# Altium schematic sheet CPU.SchDoc
size 297 x 209 mm; SheetNumber: 2; SheetTotal: 4
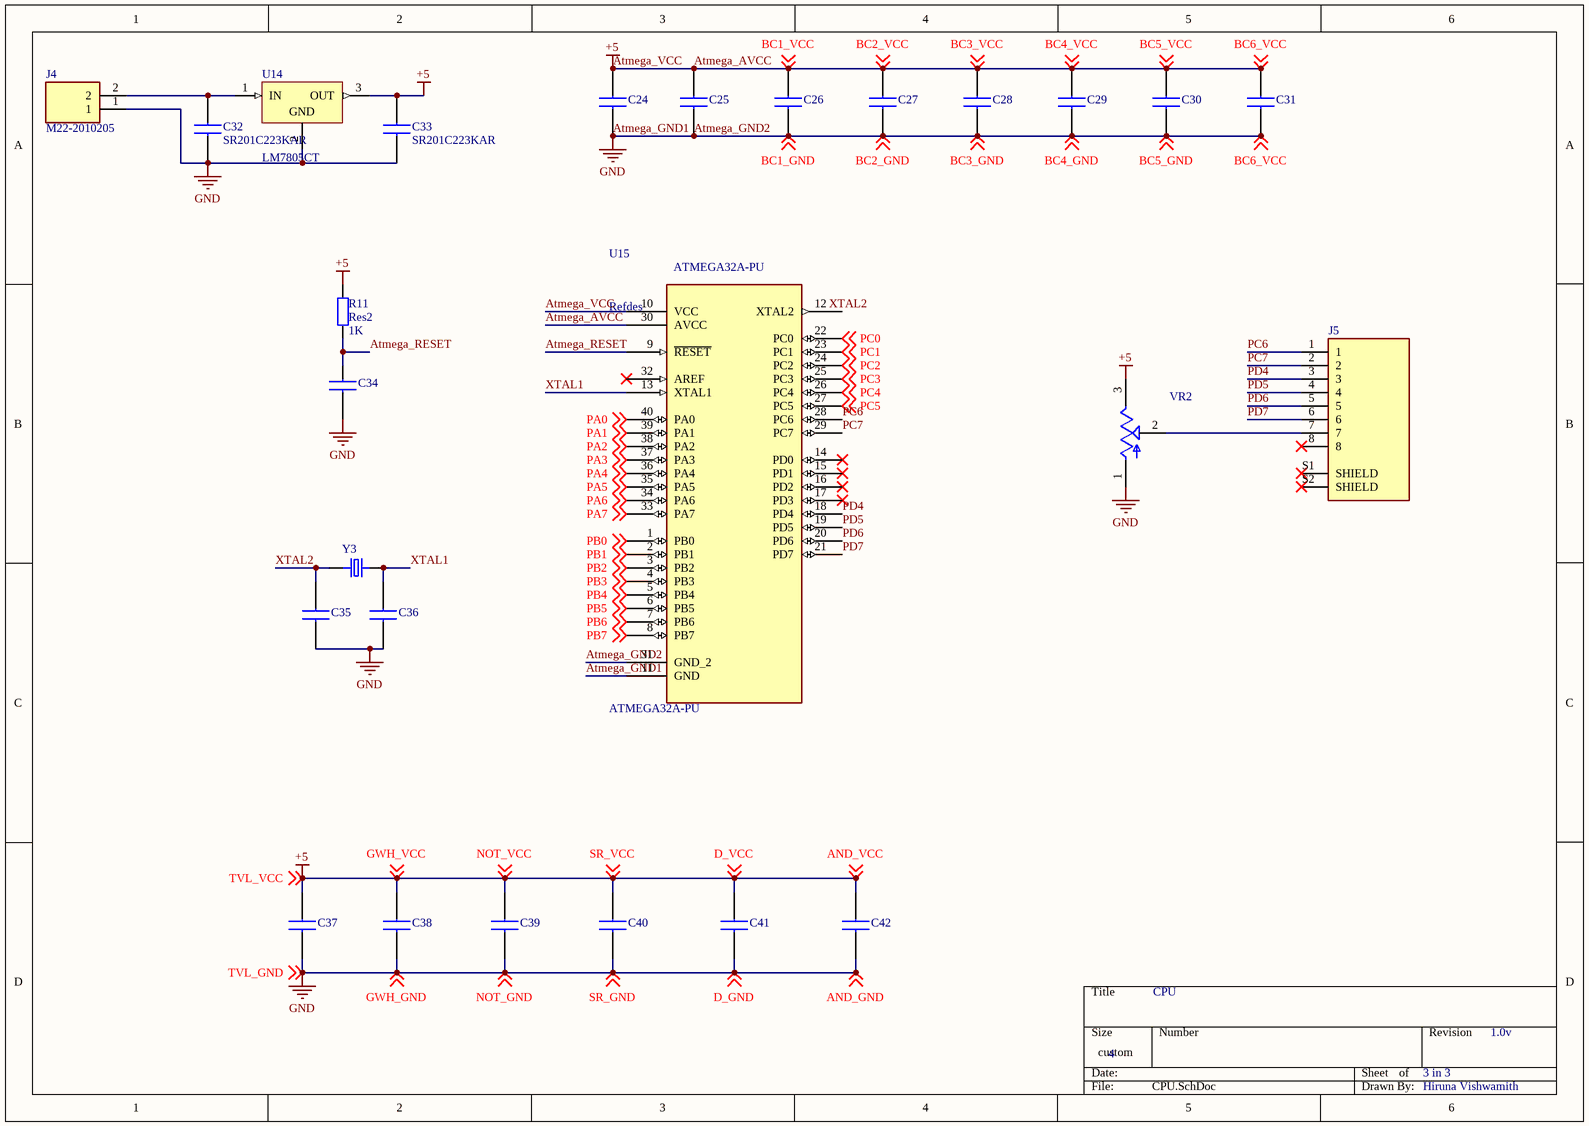
[diagram p0: CPU.SchDoc]

## Parts
C24  SR201C223KAR  [AVX-SR20]  (value not drawn)
C25  SR201C223KAR  [AVX-SR20]  (value not drawn)
C26  SR201C223KAR  [AVX-SR20]  (value not drawn)
C27  SR201C223KAR  [AVX-SR20]  (value not drawn)
C28  SR201C223KAR  [AVX-SR20]  (value not drawn)
C29  SR201C223KAR  [AVX-SR20]  (value not drawn)
C30  SR201C223KAR  [AVX-SR20]  (value not drawn)
C31  SR201C223KAR  [AVX-SR20]  (value not drawn)
C32  SR201C223KAR  [AVX-SR20]
C33  SR201C223KAR  [AVX-SR20]
C34  SR201C223KAR  [AVX-SR20]  (value not drawn)
C35  SR201C223KAR  [AVX-SR20]  (value not drawn)
C36  SR201C223KAR  [AVX-SR20]  (value not drawn)
C37  SR201C223KAR  [AVX-SR20]  (value not drawn)
C38  SR201C223KAR  [AVX-SR20]  (value not drawn)
C39  SR201C223KAR  [AVX-SR20]  (value not drawn)
C40  SR201C223KAR  [AVX-SR20]  (value not drawn)
C41  SR201C223KAR  [AVX-SR20]  (value not drawn)
C42  SR201C223KAR  [AVX-SR20]  (value not drawn)
J4  M22-2010205  [HDRV2W50P0X200_1X2_400X200X525P]
J5  59453-082110EDHLF  [AMPHENOL_59453-082110EDHLF]  (value not drawn)
R11  Res2  value 1K  [AXIAL-0.4]
U14  LM7805CT  [FAIR-TO-220-3]
U15  ATMEGA32A-PU  [DIP254P1524X482-40]
VR2  3362P-1-253LF  [TRIM_3362P-1-253LF]  (value not drawn)
Y3  ECS-240.0001-18-1X  [XTAL_ECS-200-20-1X]  (value not drawn)

## Nets
Atmega_AVCC: C24.1 C24.2 C25.1 C25.2 C26.1 C26.2 C27.1 C27.2 C28.1 C28.2 C29.1 C29.2 C30.1 C30.2 C31.1 C31.2 C32.1 C33.1 C33.2 C34.2 C35.1 C36.1 C37.1 C37.2 C38.1 C38.2 C39.1 C39.2 C40.1 C40.2 C41.1 C41.2 C42.1 C42.2 J4.1 R11.2 U14.2(GND) U14.3(OUT) U15.10(VCC) U15.11(GND) U15.30(AVCC) U15.31(GND_2) VR2.1(CCW) VR2.3(CW) ; off-sheet BC1_VCC, off-sheet BC2_VCC, off-sheet BC1_GND, off-sheet BC2_GND, off-sheet BC3_GND, off-sheet BC3_VCC, off-sheet BC4_VCC, off-sheet BC5_VCC, off-sheet BC6_VCC, off-sheet BC4_GND, off-sheet BC5_GND, off-sheet GWH_VCC, off-sheet GWH_GND, off-sheet NOT_VCC, off-sheet NOT_GND, off-sheet SR_VCC, off-sheet SR_GND, off-sheet TVL_VCC, off-sheet TVL_GND, off-sheet D_VCC, off-sheet AND_VCC, off-sheet D_GND, off-sheet AND_GND  [also labelled +5, AND_GND, AND_VCC, Atmega_GND1, Atmega_GND2, Atmega_VCC, BC1_GND, BC1_VCC, BC2_GND, BC2_VCC, BC3_GND, BC3_VCC, BC4_GND, BC4_VCC, BC5_GND, BC5_VCC, BC6_VCC, D_GND, D_VCC, GND, GWH_GND, GWH_VCC, NOT_GND, NOT_VCC, SR_GND, SR_VCC, TVL_GND, TVL_VCC]
Atmega_RESET: C34.1 R11.1 U15.9(~{RESET})
PA0: U15.40(PA0) ; off-sheet PA0
PA1: U15.39(PA1) ; off-sheet PA1
PA2: U15.38(PA2) ; off-sheet PA2
PA3: U15.37(PA3) ; off-sheet PA3
PA4: U15.36(PA4) ; off-sheet PA4
PA5: U15.35(PA5) ; off-sheet PA5
PA6: U15.34(PA6) ; off-sheet PA6
PA7: U15.33(PA7) ; off-sheet PA7
PB0: U15.1(PB0) ; off-sheet PB0
PB1: U15.2(PB1) ; off-sheet PB1
PB2: U15.3(PB2) ; off-sheet PB2
PB3: U15.4(PB3) ; off-sheet PB3
PB4: U15.5(PB4) ; off-sheet PB4
PB5: U15.6(PB5) ; off-sheet PB5
PB6: U15.7(PB6) ; off-sheet PB6
PB7: U15.8(PB7) ; off-sheet PB7
PC0: U15.22(PC0) ; off-sheet PC0
PC1: U15.23(PC1) ; off-sheet PC1
PC2: U15.24(PC2) ; off-sheet PC2
PC3: U15.25(PC3) ; off-sheet PC3
PC4: U15.26(PC4) ; off-sheet PC4
PC5: U15.27(PC5) ; off-sheet PC5
PC6: J5.1 U15.28(PC6)
PC7: J5.2 U15.29(PC7)
PD4: J5.3 U15.18(PD4)
PD5: J5.4 U15.19(PD5)
PD6: J5.5 U15.20(PD6)
PD7: J5.6 U15.21(PD7)
XTAL1: C36.2 U15.13(XTAL1) Y3.2
XTAL2: C35.2 Y3.1
NetC32_2: C32.2 J4.2 U14.1(IN)
NetJ5_7: J5.7 VR2.2(WIPER)

Not connected (* = marked no-connect by the designer): J5 8* S1(SHIELD)* S2(SHIELD)*; U15 12(XTAL2) 14(PD0)* 15(PD1)* 16(PD2)* 17(PD3)* 32(AREF)*

## Notes on the sheet
- CPU
- 4
- 3 in 3
- 1.0v
- Hiruna Vishwamith
- Labels drawn without touching a wire or pin: XTAL2
- (in symbol ATMEGA32A-PU) Refdes

## Library data of the parts
C24-C42 = SR201C223KAR: Cap Ceramic 0.022uF 100V X7R 10% Radial 2.54mm 125C Bulk; Manufacturer_Name: AVX; Manufacturer_Part_Number: SR201C223KAR; Mouser Part Number: *; Mouser Price/Stock: *; Arrow Part Number: SR201C223KAR; Arrow Price/Stock: https://www.arrow.com/en/products/sr201c223kar/avx; Datasheet Link: http://datasheets.avx.com/SR-Series.pdf
J4 = M22-2010205: Header, SIL, vertical, 2 way, 2mm pitch HARWIN M22-20 Series, 2mm Pitch 2 Way 1 Row Straight PCB Header, Solder Termination, 1A; Geometry.Height: 5.25mm; Manufacturer_Name: Harwin; Manufacturer_Part_Number: M22-2010205; Mouser Part Number: 855-M22-2010205; Mouser Price/Stock: https://www.mouser.co.uk/ProductDetail/Harwin/M22-2010205?qs=xxdqPuaJ%252Ba2I8VeWvpQIzQ%3D%3D; Arrow Part Number: *; Arrow Price/Stock: *; Datasheet Link: http://uk.rs-online.com/web/p/products/6813287
J5 = 59453-082110EDHLF: 0.50mm Flex Connectors, FPC/FFC Side Entry ZIF Connector, Surface Mount, 8 Positions, Top Contact, 0.50mm (0.020in) Pitch; MF: Amphenol ICC (FCI); Price: None; Package: None; Value: *; Check_prices: https://www.snapeda.com/parts/59453-082110EDHLF/Amphenol%20FCI/view-part/5519599/?ref=eda; SnapEDA_Link: https://www.snapeda.com/parts/59453-082110EDHLF/Amphenol%20FCI/view-part/5519599/?ref=snap; Availability: In Stock; MP: 59453-082110EDHLF
R11 = Res2: Resistor; Published: 8-Jun-2000; LatestRevisionDate: 17-Jul-2002; LatestRevisionNote: Re-released for DXP Platform.; PackageReference: AXIAL-0.4; Publisher: Altium Limited; PackageDescription: Axial Device, Thru-Hole; 2 Leads; 0.4 in Pin Spacing
U14 = CMP-2000-04938-1: Positive Voltage Regulator, 5 V, 1 A, -40 to 125 degC, 3-Pin TO-220, RoHS, Tube; Manufacturer: FairchildSemiconductor; Maximum Input Voltage: 35V; Maximum Quiescent Current: 8mA; Load Regulation: 100mV; Maximum Output Current: 2.2(Typ)A; Output Type: Fixed; Typical Dropout Voltage @ Current: 2@1AV; Rad Hard: No; Output Voltage: 5V; Accuracy: ±4%; Number of Outputs: 1; Category: LinearRegulator; Package Description: 3-Pin Through Hole Device, Body 10 x 4.5 mm, Pitch 2.54 mm; Packaging: Rail/Tube; Mounting: ThroughHole; Polarity: Positive; Manufacturer URL: https://www.fairchildsemi.com/; Line Regulation: 100mV; Datasheet Version: Aug-12; Datasheet URL: https://datasheet.ciiva.com/26904/lm7805ct-26904988.pdf; Package Reference: TO-220; Package URL: https://www.fairchildsemi.com/package-drawings/TO/TO220B03.pdf; Package: 3TO-220AB; Operating Temperature: -40to125degC; Type: Linear
U15 = ATMEGA32A-PU: AVR AVRÂ® ATmega Microcontroller IC 8-Bit 16MHz 32KB (16K x 16) FLASH 40-PDIP; MF: Microchip; Price: None; Availability: In Stock; Package: PDIP-40 Microchip; MP: ATMEGA32A-PU; Value: *; SnapEDA_Link: https://www.snapeda.com/parts/ATMEGA32A-PU/Microchip/view-part/?ref=snap; Purchase-URL: https://pricing.snapeda.com/search/part/ATMEGA32A-PU/?ref=eda; Check_prices: https://www.snapeda.com/parts/ATMEGA32A-PU/Microchip/view-part/?ref=eda
VR2 = 3362P-1-253LF: 25 kOhms 0.5W, 1/2W PC Pins Through Hole Trimmer Potentiometer Cermet 1 Turn Top Adjustment; MF: Bourns; Check_prices: https://www.snapeda.com/parts/3362P-1-253LF/Bourns/view-part/493663/?ref=eda; SnapEDA_Link: https://www.snapeda.com/parts/3362P-1-253LF/Bourns/view-part/493663/?ref=snap; Availability: Good; Value: *; Purchase-URL: https://pricing.snapeda.com/search/part/3362P-1-253LF/?ref=eda; Price: None; MP: 3362P-1-253LF; Package: 3116 Bourns
Y3 = ECS-240.0001-18-1X: Crystals / Oscillators / Resonators 24.00014MHz 18pF; MF: ECS International; Package: HC49/U ECS International; Availability: Unavailable; Value: *; MP: ECS-240.0001-18-1X; Price: None; SnapEDA_Link: https://www.snapeda.com/parts/ECS-240.0001-18-1X/ECS%20International/view-part/259232/?ref=snap